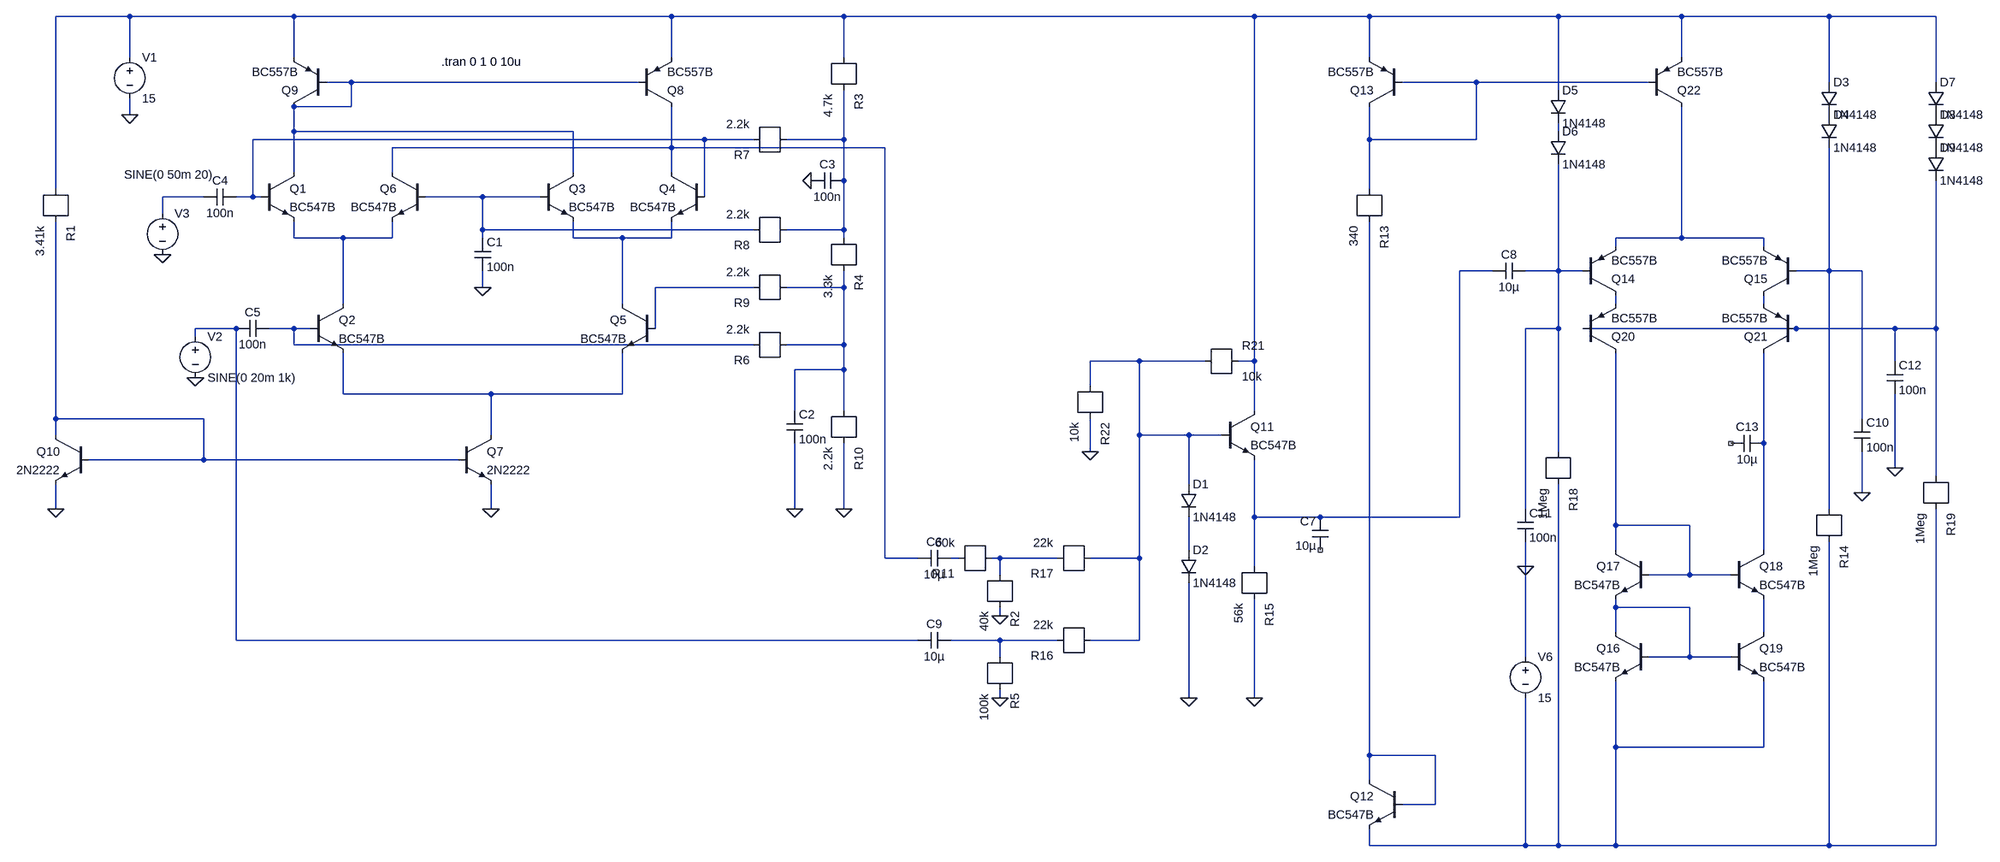
[diagram p0: schematic diff_amp.asc]
diff_amp.asc, the LTspice schematic file:
Version 4
SHEET 1 4236 1668
WIRE -80 32 -224 32
WIRE 240 32 -80 32
WIRE 976 32 240 32
WIRE 1312 32 976 32
WIRE 2112 32 1312 32
WIRE 2336 32 2112 32
WIRE 2704 32 2336 32
WIRE 2944 32 2704 32
WIRE 3232 32 2944 32
WIRE 3440 32 3232 32
WIRE -80 112 -80 32
WIRE 240 112 240 32
WIRE 976 112 976 32
WIRE 1312 112 1312 32
WIRE 2336 112 2336 32
WIRE 2944 112 2944 32
WIRE 352 160 304 160
WIRE 912 160 352 160
WIRE 2544 160 2400 160
WIRE 2880 160 2544 160
WIRE 3232 160 3232 32
WIRE 3440 160 3440 32
WIRE 2704 176 2704 32
WIRE 320 208 240 208
WIRE 352 208 352 160
WIRE 352 208 320 208
WIRE -80 224 -80 192
WIRE 240 256 240 208
WIRE 256 256 240 256
WIRE 784 256 256 256
WIRE 2704 256 2704 240
WIRE 1040 272 160 272
WIRE 1136 272 1040 272
WIRE 1312 272 1312 176
WIRE 1312 272 1200 272
WIRE 2336 272 2336 208
WIRE 2544 272 2544 160
WIRE 2544 272 2336 272
WIRE 448 288 432 288
WIRE 768 288 448 288
WIRE 976 288 976 208
WIRE 976 288 768 288
WIRE 992 288 976 288
WIRE 1392 288 992 288
WIRE 160 336 160 272
WIRE 240 336 240 256
WIRE 432 336 432 288
WIRE 784 336 784 256
WIRE 976 336 976 288
WIRE 1312 352 1312 272
WIRE -224 368 -224 32
WIRE 2336 368 2336 272
WIRE 64 384 -16 384
WIRE 160 384 160 336
WIRE 160 384 128 384
WIRE 176 384 160 384
WIRE 608 384 496 384
WIRE 720 384 608 384
WIRE 1040 384 1040 272
WIRE -16 416 -16 384
WIRE 608 448 608 384
WIRE 1136 448 608 448
WIRE 1312 448 1312 352
WIRE 1312 448 1200 448
WIRE 240 464 240 432
WIRE 336 464 240 464
WIRE 432 464 432 432
WIRE 432 464 336 464
WIRE 608 464 608 448
WIRE 784 464 784 432
WIRE 880 464 784 464
WIRE 976 464 976 432
WIRE 976 464 880 464
WIRE 1312 464 1312 448
WIRE 2944 464 2944 208
WIRE 2944 464 2816 464
WIRE 3104 464 2944 464
WIRE 2816 480 2816 464
WIRE 3104 480 3104 464
WIRE 2576 528 2512 528
WIRE 2704 528 2704 320
WIRE 2704 528 2640 528
WIRE 2752 528 2704 528
WIRE 3232 528 3232 288
WIRE 3232 528 3168 528
WIRE 3296 528 3232 528
WIRE 608 560 608 528
WIRE 1136 560 944 560
WIRE 1312 560 1312 528
WIRE 1312 560 1200 560
WIRE 336 592 336 464
WIRE 880 592 880 464
WIRE 2816 592 2816 576
WIRE 3104 592 3104 576
WIRE 128 640 48 640
WIRE 240 640 192 640
WIRE 272 640 240 640
WIRE 944 640 944 560
WIRE 2704 640 2704 528
WIRE 2704 640 2640 640
WIRE 2800 640 2752 640
WIRE 3120 640 2800 640
WIRE 3360 640 3120 640
WIRE 3440 640 3440 352
WIRE 3440 640 3360 640
WIRE 48 656 48 640
WIRE 240 672 240 640
WIRE 1136 672 240 672
WIRE 1312 672 1312 560
WIRE 1312 672 1200 672
WIRE 1888 704 1792 704
WIRE 2016 704 1888 704
WIRE 2112 704 2112 32
WIRE 2112 704 2080 704
WIRE 3360 704 3360 640
WIRE 1312 720 1312 672
WIRE 1312 720 1216 720
WIRE 1792 752 1792 704
WIRE 336 768 336 688
WIRE 624 768 336 768
WIRE 880 768 880 688
WIRE 880 768 624 768
WIRE 1216 800 1216 720
WIRE 1312 800 1312 720
WIRE 2112 800 2112 704
WIRE -224 816 -224 432
WIRE 64 816 -224 816
WIRE 3296 816 3296 528
WIRE -224 848 -224 816
WIRE 624 848 624 768
WIRE 1888 848 1888 704
WIRE 1984 848 1888 848
WIRE 2048 848 1984 848
WIRE 3104 864 3104 688
WIRE 1792 880 1792 816
WIRE 2704 880 2704 640
WIRE 64 896 64 816
WIRE 64 896 -160 896
WIRE 560 896 64 896
WIRE 3360 912 3360 768
WIRE 3440 928 3440 640
WIRE 1984 944 1984 848
WIRE 3296 960 3296 880
WIRE -224 992 -224 944
WIRE 624 992 624 944
WIRE 1216 992 1216 864
WIRE 1312 992 1312 864
WIRE 2640 992 2640 640
WIRE 3232 992 3232 528
WIRE 2112 1008 2112 896
WIRE 2240 1008 2112 1008
WIRE 2512 1008 2512 528
WIRE 2512 1008 2240 1008
WIRE 2816 1024 2816 688
WIRE 2832 1024 2816 1024
WIRE 2960 1024 2832 1024
WIRE 1984 1072 1984 1008
WIRE 2816 1072 2816 1024
WIRE 3104 1072 3104 864
WIRE 1392 1088 1392 288
WIRE 1456 1088 1392 1088
WIRE 1536 1088 1520 1088
WIRE 1616 1088 1600 1088
WIRE 1728 1088 1616 1088
WIRE 1888 1088 1888 848
WIRE 1888 1088 1792 1088
WIRE 2112 1104 2112 1008
WIRE 2640 1104 2640 1056
WIRE 1616 1120 1616 1088
WIRE 2960 1120 2960 1024
WIRE 2960 1120 2880 1120
WIRE 3040 1120 2960 1120
WIRE 2816 1184 2816 1168
WIRE 2832 1184 2816 1184
WIRE 2960 1184 2832 1184
WIRE 1616 1200 1616 1184
WIRE 2816 1232 2816 1184
WIRE 3104 1232 3104 1168
WIRE 128 1248 128 640
WIRE 1456 1248 128 1248
WIRE 1616 1248 1520 1248
WIRE 1728 1248 1616 1248
WIRE 1888 1248 1888 1088
WIRE 1888 1248 1792 1248
WIRE 1616 1280 1616 1248
WIRE 2640 1280 2640 1104
WIRE 2960 1280 2960 1184
WIRE 2960 1280 2880 1280
WIRE 3040 1280 2960 1280
WIRE 1616 1360 1616 1344
WIRE 1984 1360 1984 1136
WIRE 2112 1360 2112 1168
WIRE 2816 1456 2816 1328
WIRE 3104 1456 3104 1328
WIRE 3104 1456 2816 1456
WIRE 2336 1472 2336 432
WIRE 2352 1472 2336 1472
WIRE 2464 1472 2352 1472
WIRE 2336 1520 2336 1472
WIRE 2464 1568 2464 1472
WIRE 2464 1568 2400 1568
WIRE 2336 1648 2336 1616
WIRE 2640 1648 2640 1360
WIRE 2640 1648 2336 1648
WIRE 2704 1648 2704 944
WIRE 2704 1648 2640 1648
WIRE 2816 1648 2816 1456
WIRE 2816 1648 2704 1648
WIRE 3232 1648 3232 1056
WIRE 3232 1648 2816 1648
WIRE 3440 1648 3440 992
WIRE 3440 1648 3232 1648
FLAG 608 560 0
FLAG 624 992 0
FLAG -80 224 0
FLAG -16 496 0
FLAG 48 736 0
FLAG 1216 992 0
FLAG 1312 992 0
FLAG -224 992 0
FLAG 1248 352 0
FLAG 1616 1200 0
FLAG 1616 1360 0
FLAG 2112 1360 0
FLAG 1984 1360 0
FLAG 3296 960 0
FLAG 2640 1104 0
FLAG 3360 912 0
FLAG 1792 880 0
SYMBOL npn 176 336 R0
SYMATTR InstName Q1
SYMATTR Value BC547B
SYMBOL npn -160 848 M0
SYMATTR InstName Q10
SYMATTR Value 2N2222
SYMBOL r -224 368 R90
SYMATTR InstName R1
SYMATTR Value 3.41k
SYMBOL cap 592 464 R0
SYMATTR InstName C1
SYMATTR Value 100n
SYMBOL r 1312 112 R90
SYMATTR InstName R3
SYMATTR Value 4.7k
SYMBOL r 1312 464 R90
SYMATTR InstName R4
SYMATTR Value 3.3k
SYMBOL r 1200 672 R180
SYMATTR InstName R6
SYMATTR Value 2.2k
SYMBOL r 1200 272 R180
SYMATTR InstName R7
SYMATTR Value 2.2k
SYMBOL r 1200 448 R180
SYMATTR InstName R8
SYMATTR Value 2.2k
SYMBOL r 1200 560 R180
SYMATTR InstName R9
SYMATTR Value 2.2k
SYMBOL r 1312 800 R90
SYMATTR InstName R10
SYMATTR Value 2.2k
SYMBOL cap 1312 336 R90
WINDOW 0 0 32 VBottom 2
WINDOW 3 32 32 VTop 2
SYMATTR InstName C3
SYMATTR Value 100n
SYMBOL voltage -80 96 R0
SYMATTR InstName V1
SYMATTR Value 15
SYMBOL voltage 48 640 R0
SYMATTR InstName V2
SYMATTR Value SINE(0 20m 1k)
SYMATTR Value2 AC 1
SYMBOL voltage -16 400 R0
WINDOW 3 -75 -60 Left 2
SYMATTR Value SINE(0 50m 20)
SYMATTR InstName V3
SYMATTR Value2 AC 1
SYMBOL cap 128 368 R90
WINDOW 0 0 32 VBottom 2
WINDOW 3 32 32 VTop 2
SYMATTR InstName C4
SYMATTR Value 100n
SYMBOL cap 192 624 R90
WINDOW 0 0 32 VBottom 2
WINDOW 3 32 32 VTop 2
SYMATTR InstName C5
SYMATTR Value 100n
SYMBOL cap 1200 800 R0
SYMATTR InstName C2
SYMATTR Value 100n
SYMBOL npn 272 592 R0
SYMATTR InstName Q2
SYMATTR Value BC547B
SYMBOL npn 720 336 R0
SYMATTR InstName Q3
SYMATTR Value BC547B
SYMBOL npn 1040 336 M0
SYMATTR InstName Q4
SYMATTR Value BC547B
SYMBOL npn 944 592 M0
SYMATTR InstName Q5
SYMATTR Value BC547B
SYMBOL npn 496 336 M0
SYMATTR InstName Q6
SYMATTR Value BC547B
SYMBOL npn 560 848 R0
SYMATTR InstName Q7
SYMATTR Value 2N2222
SYMBOL pnp 912 208 M180
SYMATTR InstName Q8
SYMATTR Value BC557B
SYMBOL pnp 304 208 R180
SYMATTR InstName Q9
SYMATTR Value BC557B
SYMBOL r 1616 1120 R90
SYMATTR InstName R2
SYMATTR Value 40k
SYMBOL r 1616 1280 R90
SYMATTR InstName R5
SYMATTR Value 100k
SYMBOL cap 1520 1072 R90
WINDOW 0 0 32 VBottom 2
WINDOW 3 32 32 VTop 2
SYMATTR InstName C6
SYMATTR Value 10µ
SYMBOL cap 1520 1232 R90
WINDOW 0 0 32 VBottom 2
WINDOW 3 32 32 VTop 2
SYMATTR InstName C9
SYMATTR Value 10µ
SYMBOL r 2112 1104 R90
SYMATTR InstName R15
SYMATTR Value 56k
SYMBOL r 1792 1248 R180
SYMATTR InstName R16
SYMATTR Value 22k
SYMBOL r 1792 1088 R180
SYMATTR InstName R17
SYMATTR Value 22k
SYMBOL r 1600 1088 R180
SYMATTR InstName R11
SYMATTR Value 60k
SYMBOL npn 2048 800 R0
SYMATTR InstName Q11
SYMATTR Value BC547B
SYMBOL diode 1968 944 R0
SYMATTR InstName D1
SYMATTR Value 1N4148
SYMBOL diode 1968 1072 R0
SYMATTR InstName D2
SYMATTR Value 1N4148
SYMBOL npn 2400 1520 M0
SYMATTR InstName Q12
SYMATTR Value BC547B
SYMBOL r 2336 368 R90
SYMATTR InstName R13
SYMATTR Value 340
SYMBOL pnp 2400 208 R180
SYMATTR InstName Q13
SYMATTR Value BC557B
SYMBOL cap 2640 512 R90
WINDOW 0 0 32 VBottom 2
WINDOW 3 32 32 VTop 2
SYMATTR InstName C8
SYMATTR Value 10µ
SYMBOL diode 3216 160 R0
SYMATTR InstName D3
SYMATTR Value 1N4148
SYMBOL diode 3216 224 R0
SYMATTR InstName D4
SYMATTR Value 1N4148
SYMBOL r 3232 992 R90
SYMATTR InstName R14
SYMATTR Value 1Meg
SYMBOL cap 3280 816 R0
SYMATTR InstName C10
SYMATTR Value 100n
SYMBOL pnp 2752 576 M180
SYMATTR InstName Q14
SYMATTR Value BC557B
SYMBOL pnp 3168 576 R180
SYMATTR InstName Q15
SYMATTR Value BC557B
SYMBOL diode 2688 176 R0
SYMATTR InstName D5
SYMATTR Value 1N4148
SYMBOL diode 2688 256 R0
SYMATTR InstName D6
SYMATTR Value 1N4148
SYMBOL r 2704 880 R90
SYMATTR InstName R18
SYMATTR Value 1Meg
SYMBOL npn 2880 1232 M0
SYMATTR InstName Q16
SYMATTR Value BC547B
SYMBOL npn 2880 1072 M0
SYMATTR InstName Q17
SYMATTR Value BC547B
SYMBOL npn 3040 1072 R0
SYMATTR InstName Q18
SYMATTR Value BC547B
SYMBOL npn 3040 1232 R0
SYMATTR InstName Q19
SYMATTR Value BC547B
SYMBOL pnp 2752 688 M180
SYMATTR InstName Q20
SYMATTR Value BC557B
SYMBOL pnp 3168 688 R180
SYMATTR InstName Q21
SYMATTR Value BC557B
SYMBOL pnp 2880 208 M180
SYMATTR InstName Q22
SYMATTR Value BC557B
SYMBOL voltage 2640 1264 R0
SYMATTR InstName V6
SYMATTR Value 15
SYMBOL diode 3424 160 R0
SYMATTR InstName D7
SYMATTR Value 1N4148
SYMBOL diode 3424 224 R0
SYMATTR InstName D8
SYMATTR Value 1N4148
SYMBOL diode 3424 288 R0
SYMATTR InstName D9
SYMATTR Value 1N4148
SYMBOL r 3440 928 R90
SYMATTR InstName R19
SYMATTR Value 1Meg
SYMBOL cap 2624 992 R0
SYMATTR InstName C11
SYMATTR Value 100n
SYMBOL cap 3344 704 R0
SYMATTR InstName C12
SYMATTR Value 100n
SYMBOL r 2016 704 R0
SYMATTR InstName R21
SYMATTR Value 10k
SYMBOL r 1792 752 R90
SYMATTR InstName R22
SYMATTR Value 10k
SYMBOL cap 2256 1072 R180
WINDOW 0 24 56 Left 2
WINDOW 3 24 8 Left 2
SYMATTR InstName C7
SYMATTR Value 10µ
SYMBOL cap 3040 880 R270
WINDOW 0 32 32 VTop 2
WINDOW 3 0 32 VBottom 2
SYMATTR InstName C13
SYMATTR Value 10µ
TEXT 528 120 Left 2 !.tran 0 1 0 10u

The netlist it stands for:
* diff_amp.asc
Q1 N002 N005 N010 0 BC547B
Q10 N025 N025 0 0 2N2222
R1 N025 N001 3.41k
C1 N009 0 100n
R3 N006 N001 4.7k
R4 N017 N006 3.3k
R6 N021 N017 2.2k
R7 N005 N006 2.2k
R8 N009 N006 2.2k
R9 N016 N017 2.2k
R10 0 N017 2.2k
C3 N006 0 100n
V1 N001 0 15
V2 N020 0 SINE(0 20m 1k) AC 1
V3 N008 0 SINE(0 50m 20) AC 1
C4 N005 N008 100n
C5 N021 N020 100n
C2 N017 0 100n
Q2 N010 N021 N024 0 BC547B
Q3 N002 N009 N011 0 BC547B
Q4 N007 N005 N011 0 BC547B
Q5 N011 N016 N024 0 BC547B
Q6 N007 N009 N010 0 BC547B
Q7 N024 N025 0 0 2N2222
Q8 N007 N002 N001 0 BC557B
Q9 N002 N002 N001 0 BC557B
R2 0 N030 40k
R5 0 N033 100k
C6 N029 N007 10µ
C9 N033 N020 10µ
R15 0 N013 56k
R16 N033 N023 22k
R17 N030 N023 22k
R11 N029 N030 60k
Q11 N001 N023 N013 0 BC547B
D1 N023 N028 1N4148
D2 N028 0 1N4148
Q12 N035 N035 N034 0 BC547B
R13 N035 N003 340
Q13 N003 N003 N001 0 BC557B
C8 N014 N013 10µ
D3 N001 P001 1N4148
D4 P001 N015 1N4148
R14 N034 N015 1Meg
C10 N015 0 100n
Q14 N018 N014 N012 0 BC557B
Q15 N019 N015 N012 0 BC557B
D5 N001 N004 1N4148
D6 N004 N014 1N4148
R18 N034 N014 1Meg
Q16 N031 N031 N034 0 BC547B
Q17 N027 N027 N031 0 BC547B
Q18 N026 N027 N032 0 BC547B
Q19 N032 N031 N034 0 BC547B
Q20 N027 N022 N018 0 BC557B
Q21 N026 N022 N019 0 BC557B
Q22 N012 N003 N001 0 BC557B
V6 0 N034 15
D7 N001 P002 1N4148
D8 P002 P003 1N4148
D9 P003 N022 1N4148
R19 N034 N022 1Meg
C11 N014 0 100n
C12 N022 0 100n
R21 N001 N023 10k
R22 0 N023 10k
C7 NC_01 N013 10µ
C13 NC_02 N026 10µ
.model D D
.lib standard.dio
.model NPN NPN
.model PNP PNP
.lib standard.bjt
.tran 0 1 0 10u
.backanno
.end